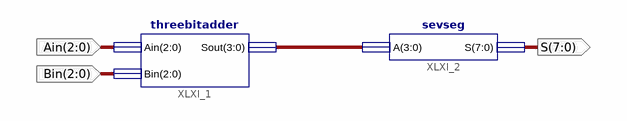
[diagram p0: schematic sheet 1]
// Xilinx ISE schematic deney6sch.sch (spartan3e) as structural Verilog: 2 symbols, 3 ports
module deney6sch (
  input  [2:0] Ain,
  input  [2:0] Bin,
  output [7:0] S
);

  wire [3:0] XLXN_3;

  threebitadder XLXI_1 (.Ain(Ain), .Bin(Bin), .Sout(XLXN_3));
  sevseg XLXI_2 (.A(XLXN_3), .S(S));
endmodule
